# Altium project PCB_Project_1.PrjPcb
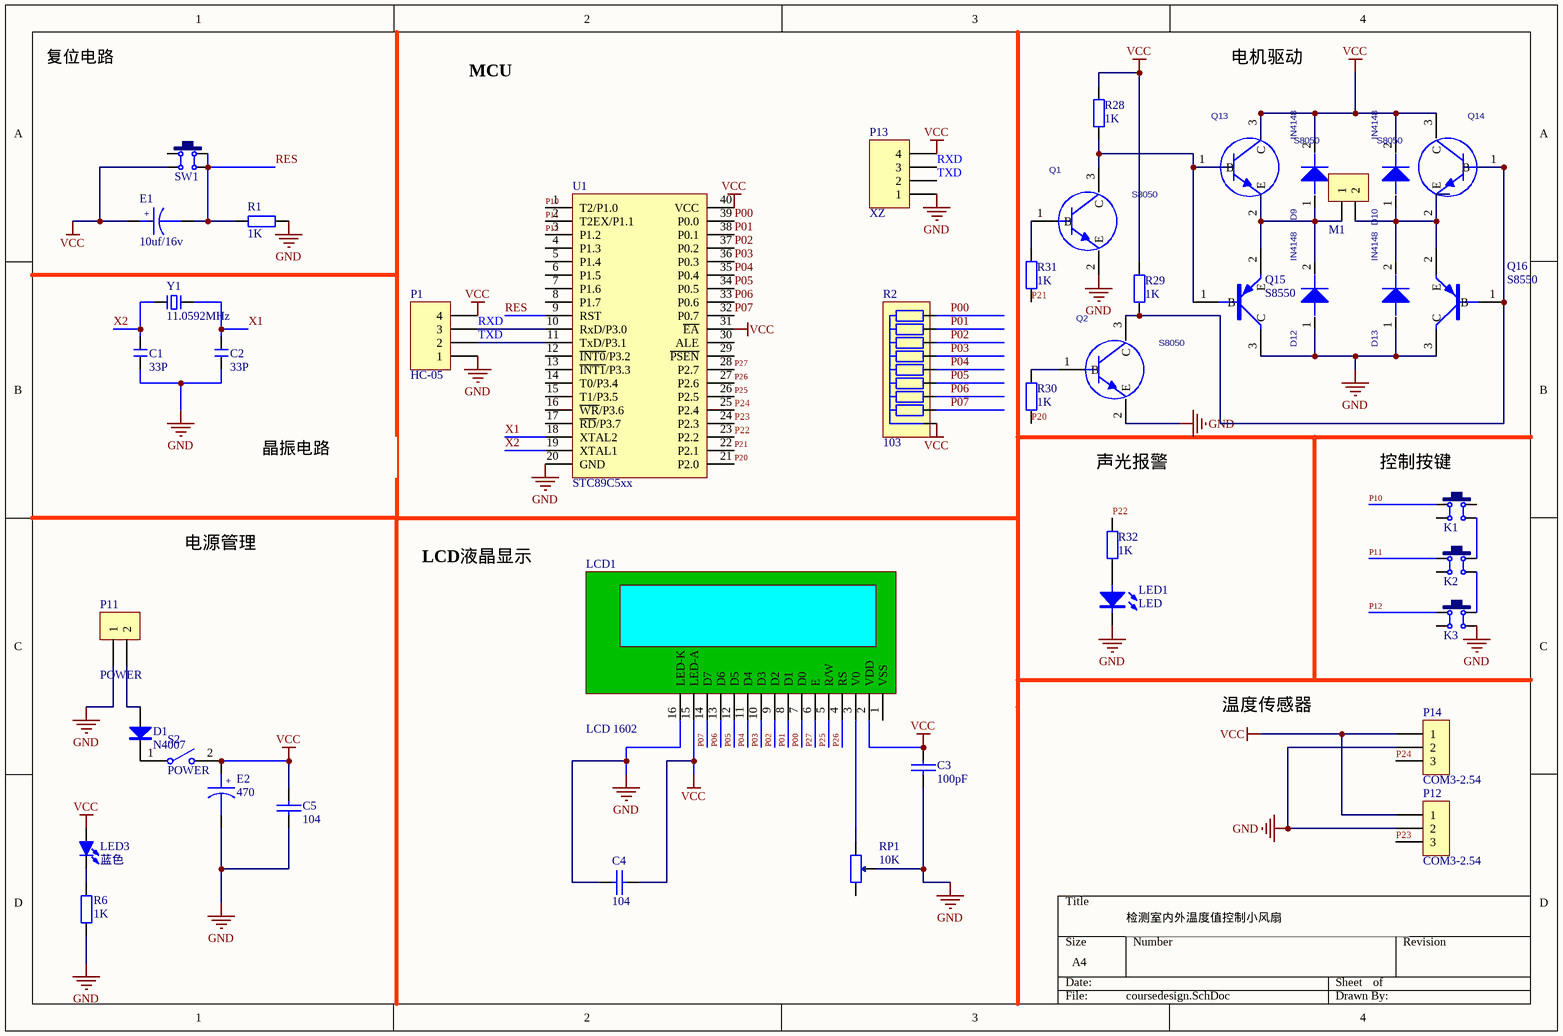
[diagram p0: coursedesign.SchDoc]
1 sheet, 43 parts. Net scope: global (net labels, ports and power ports of the same name join across sheets).
Board file: PCBdesign.PcbDoc

## Sheet coursedesign.SchDoc
size A4

### Parts
C1  33P  [CC 1.8*3.6]
C2  33P  [CC 1.8*3.6]
C3  100pF  [RAD0.1]
C4  104  [RAD0.1]
C5  104  [RAD0.1]
D1  N4007  [DO-41]
D9  IN4148  [DIODE_SOP]
D10  IN4148  [DIODE_SOP]
D12  IN4148  [DIODE_SOP]
D13  IN4148  [DIODE_SOP]
E1  10uf/16v  [CAP_2]
E2  470  [CAP_2]
K1  6x6x5  [TSW DIP-6*6*6]  (value not drawn)
K2  6x6x5  [TSW DIP-6*6*6]  (value not drawn)
K3  6x6x5  [TSW DIP-6*6*6]  (value not drawn)
LCD1  LCD 1602  [LCD-1602]
LED1  LED  [LED-D5]
LED3  蓝色  [LED 5MM-G]
M1  HDR-1X2  [HDR2.54-LI-2P]  (value not drawn)
P1  HC-05  [HDR1X4]
P11  POWER  [COM2-2.54]
P12  COM3-2.54  [COM3-2.54]
P13  XZ  [HDR1X4]
P14  COM3-2.54  [COM3-2.54]
Q1  S8050  [TO-92]
Q2  S8050  [TO-92]
Q13  S8050  [TO-92]
Q14  S8050  [TO-92]
Q15  S8550  [TO-92]
Q16  S8550  [TO-92]
R1  1K  [RS 1/4W]
R2  103  [R SIP9-2.54]
R6  1K  [RS 1/4W]
R28  1K  [RES-0.25W-6.5X2.5-10.16-0.6]
R29  1K  [RES-0.25W-6.5X2.5-10.16-0.6]
R30  1K  [RES-0.25W-6.5X2.5-10.16-0.6]
R31  1K  [RES-0.25W-6.5X2.5-10.16-0.6]
R32  1K  [RES-0.25W-6.5X2.5-10.16-0.6]
RP1  10K  [3296W]
S2  POWER  [KCD1-101]
SW1  6x6x5  [TSW DIP-6*6*6]  (value not drawn)
U1  STC89C5xx  [DIP40-600]
Y1  11.0592MHz  [OSC HC-49S]

### Nets
GND: C1.2 C2.2 C3.1 C4.1 C5.2 D12.1(+) D13.1(+) E2.2 K3.3 LCD1.16(LED-K) LED1.2(C) P1.1 P11.1 P12.2 P13.1 P14.2 Q1.2(E) Q2.2(E) Q15.3(C) Q16.3(C) R1.2 R6.1 RP1.2 U1.20(GND)
VCC: C3.2 C4.2 C5.1 D9.2(-) D10.2(-) E1.1 E2.1 LCD1.2(VDD) LCD1.15(LED-A) LED3.1(A) P1.4 P12.1 P13.4 P14.1 Q13.3(C) Q14.3(C) R2.1 R28.2 R29.2 S2.2 SW1.4 U1.31(~{EA}) U1.40(VCC)
P00: LCD1.7(D0) R2.9 U1.39(P0.0)
P01: LCD1.8(D1) R2.8 U1.38(P0.1)
P02: LCD1.9(D2) R2.7 U1.37(P0.2)
P03: LCD1.10(D3) R2.6 U1.36(P0.3)
P04: LCD1.11(D4) R2.5 U1.35(P0.4)
P05: LCD1.12(D5) R2.4 U1.34(P0.5)
P06: LCD1.13(D6) R2.3 U1.33(P0.6)
P07: LCD1.14(D7) R2.2 U1.32(P0.7)
P10: K1.1 U1.1(T2/P1.0)
P11: K2.1 U1.2(T2EX/P1.1)
P12: K3.1 U1.3(P1.2)
P20: R30.1 U1.21(P2.0)
P21: R31.1 U1.22(P2.1)
P22: R32.2 U1.23(P2.2)
P23: P12.3 U1.24(P2.3)
P24: P14.3 U1.25(P2.4)
P25: LCD1.5(R/W) U1.26(P2.5)
P26: LCD1.4(RS) U1.27(P2.6)
P27: LCD1.6(E) U1.28(P2.7)
RES: E1.2 R1.1 SW1.2 SW1.3 U1.9(RST)
RXD: P1.3 P13.3 U1.10(RxD/P3.0)
TXD: P1.2 P13.2 U1.11(TxD/P3.1)
X1: C2.1 U1.18(XTAL2) Y1.2
X2: C1.1 U1.19(XTAL1) Y1.1
NetD1_1: D1.1(A) P11.2
NetD1_2: D1.2(K) S2.1
NetD9_1: D9.1(+) D12.2(-) M1.1 Q13.2(E) Q15.2(E)
NetD10_1: D10.1(+) D13.2(-) M1.2 Q14.2(E) Q16.2(E)
NetK1_3: K1.3 K2.2
NetK2_3: K2.3 K3.2
NetLCD1_3: LCD1.3(V0) RP1.1
NetLED1_1: LED1.1(A) R32.1
NetLED3_2: LED3.2(K) R6.2
NetQ1_1: Q1.1(B) R31.2
NetQ1_3: Q1.3(C) Q13.1(B) Q15.1(B) R28.1
NetQ2_1: Q2.1(B) R30.2
NetQ2_3: Q2.3(C) Q14.1(B) Q16.1(B) R29.1

Not connected (* = marked no-connect by the designer): K1 2 4; K2 4; K3 4; LCD1 1(VSS); RP1 3; SW1 1; U1 4(P1.3) 5(P1.4) 6(P1.5) 7(P1.6) 8(P1.7) 12(~{INT0}/P3.2) 13(~{INT1}/P3.3) 14(T0/P3.4) 15(T1/P3.5) 16(~{WR}/P3.6) 17(~{RD}/P3.7) 29(~{PSEN}) 30(ALE)

### Notes on the sheet
- 复位电路
- MCU
- 电机驱动
- 晶振电路
- 声光报警
- (near K1) 控制按键
- 电源管理
- LCD液晶显示
- 温度传感器
- 检测室内外温度值控制小风扇
- (in symbol 电解电容) +

### Library data of the parts
C1 C2 = C-CC: 直插瓷片电容; 版权归属: 源创客; BOM名称: 直插瓷片电容; 学习资源: www.ooocke.com
C3-C5 = 普通电容: Capacitor
D1 = 1N4007: 整流二极管; 版权归属: 源创客; BOM名称: 整流二极管; 学习资源: www.ooocke.com
E1 E2 = 电解电容: Capacitor
K1-K3 SW1 = TSW DIP-6x6: 直插6x6轻触开关; 版权归属: 源创客; BOM名称: 直插6x6轻触开关; 学习资源: www.ooocke.com
LCD1 = LCD 1602: 版权归属: 源创客; BOM名称: LCD 1602; 学习资源: www.ooocke.com
LED3 = LED-5MM: 5mm插件LED; 版权归属: 源创客; BOM名称: 5mm插件LED; 学习资源: www.ooocke.com
M1 = Header 2: 2P接插件; 版权归属: 源创客; BOM名称: 2P接插件; 学习资源: www.ooocke.com
P1 P13 = Header 4: Header, 4-Pin; LatestRevisionDate: 17-Jul-2002; LatestRevisionNote: Re-released for DXP Platform.; Publisher: Altium Limited
P11 = COM2-2.54
Q1 Q2 Q13 Q14 = S8050: NPN; pin to pad: 1>2 2>1; PCB DECAL: SOT-23; Manufacturer #2: 8050
Q15 Q16 = S8550: PNP; pin to pad: 1>2 2>1
R1 R6 = R-CRR: 直插色环电阻; BOM名称: 色环电阻; 版权归属: 源创客; 学习资源: www.ooocke.com
R2 = R SIP9: 单列直插排阻; 版权归属: 源创客; BOM名称: 单列直插排阻; 学习资源: www.ooocke.com
R28-R32 = RES: Resistor
RP1 = RP-ID: 插件单联电位器; BOM名称: 插件电位器; 版权归属: 源创客; 学习资源: www.ooocke.com
S2 = KCD1-101: 1路单刀船型开关; 版权归属: 源创客; BOM名称: 1路单刀船型开关; 学习资源: www.ooocke.com
U1 = STC89C5xx: STC单片机; 版权归属: 源创客; BOM名称: STC单片机; 学习资源: www.ooocke.com
Y1 = XTAL-2P: 2脚无源脚晶振; 版权归属: 源创客; BOM名称: 2脚无源脚晶振; 学习资源: www.ooocke.com
D9 D10 D12 D13 = IN4148: PCB DECAL: DIODE_SOP; VALUE: IN4148